# Altium schematic sheet Digital_Clock_SCH_4.0.SchDoc
size A; SheetNumber: 1; SheetTotal: 1
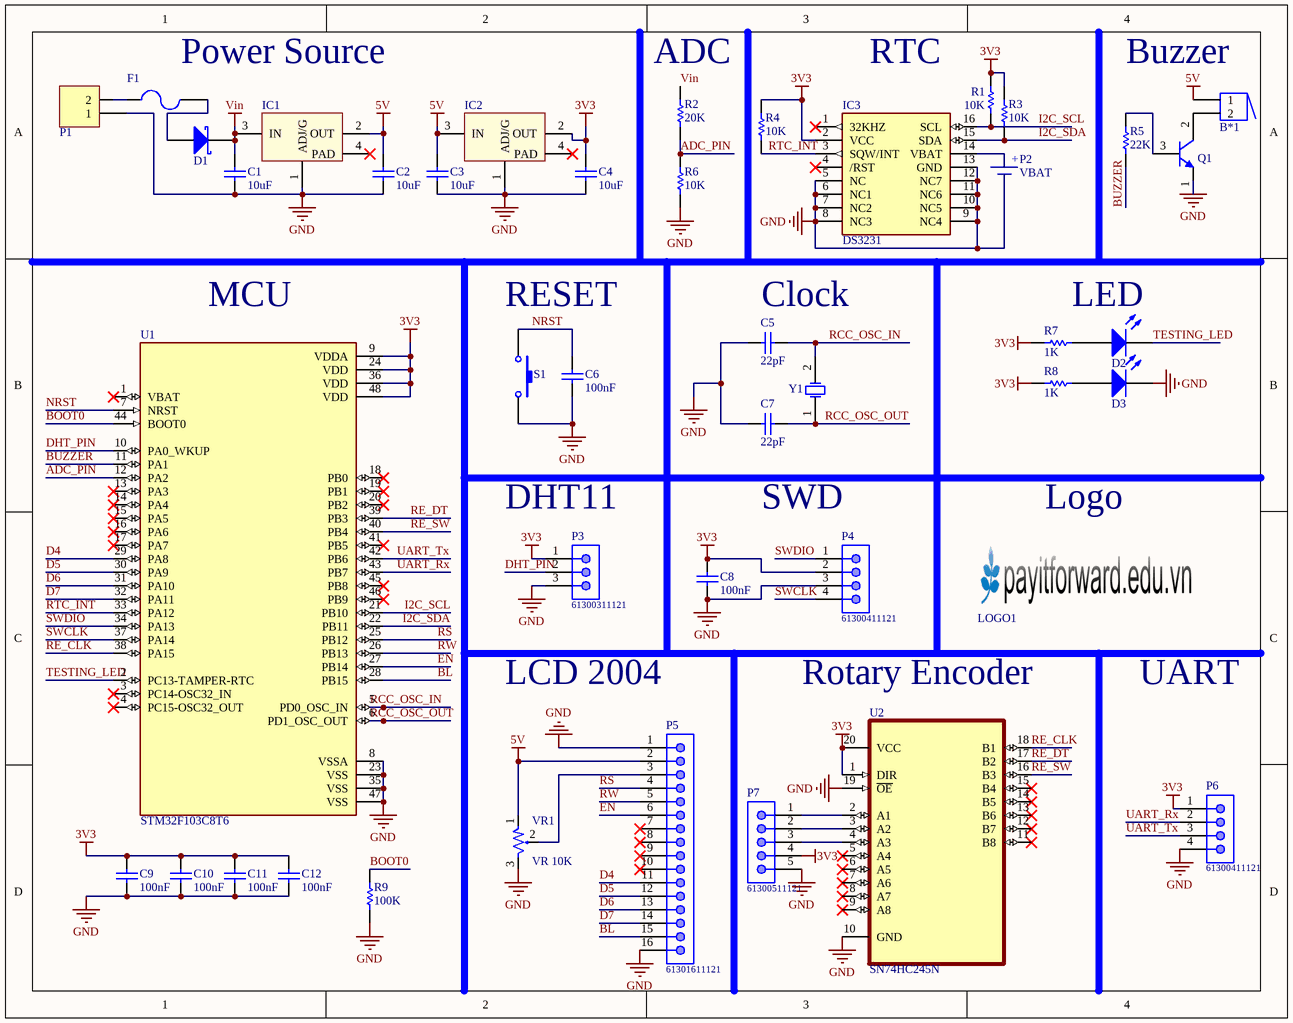
[diagram p0: Digital_Clock_SCH_4.0.SchDoc]

## Parts
B*1  Buzzer  [BUZZER]  (value not drawn)
C1  value 10uF  [CAP-SM-0805]  (hidden comment: Cap Non-Pol SMD)
C2  value 10uF  [CAP-SM-0805]  (hidden comment: Cap Non-Pol SMD)
C3  value 10uF  [CAP-SM-0805]  (hidden comment: Cap Non-Pol SMD)
C4  value 10uF  [CAP-SM-0805]  (hidden comment: Cap Non-Pol SMD)
C5  value 22pF  [CAP-SM-0603]  (hidden comment: Cap Non-Pol SMD)
C6  value 100nF  [CAP-SM-0603]  (hidden comment: Cap Non-Pol SMD)
C7  value 22pF  [CAP-SM-0603]  (hidden comment: Cap Non-Pol SMD)
C8  value 100nF  [CAP-SM-0603]  (hidden comment: Cap Non-Pol SMD)
C9  value 100nF  [CAP-SM-0603]  (hidden comment: Cap Non-Pol SMD)
C10  value 100nF  [CAP-SM-0603]  (hidden comment: Cap Non-Pol SMD)
C11  value 100nF  [CAP-SM-0603]  (hidden comment: Cap Non-Pol SMD)
C12  value 100nF  [CAP-SM-0603]  (hidden comment: Cap Non-Pol SMD)
D1  D Schottky  [SS34]  (value not drawn)
D2  LED SMD  [LED_0805_Blue]  (value not drawn)
D3  LED SMD  [LED_0805_Blue]  (value not drawn)
F1  Fuse  [FUSE SMD]  (value not drawn)
IC1  LM1117  [SOT223-4N]  (value not drawn)
IC2  LM1117  [SOT223-4N]  (value not drawn)
IC3  DS3231  [SO16W]  (value not drawn)
LOGO1  LOGO PIF  [PIF LOGO BIG SSTOP]  (value not drawn)
P1  Domino 2  [DOMINO SMALL 2]  (value not drawn)
P2  VBAT  [VBAT CR2030]
P3  61300311121  [61300311121]
P4  61300411121  [61300411121]
P5  61301611121  [61301611121]
P6  61300411121  [61300411121]
P7  61300511121  [61300511121]
Q1  C1815  [SOT23B]  (value not drawn)
R1  value 10K  [RES-SM-0603]  (hidden comment: RESISTOR SMD)
R2  value 20K  [RES-SM-0603]  (hidden comment: RESISTOR SMD)
R3  value 10K  [RES-SM-0603]  (hidden comment: RESISTOR SMD)
R4  value 10K  [RES-SM-0603]  (hidden comment: RESISTOR SMD)
R5  value 22K  [RES-SM-0603]  (hidden comment: RESISTOR SMD)
R6  value 10K  [RES-SM-0603]  (hidden comment: RESISTOR SMD)
R7  value 1K  [RES-SM-0603]  (hidden comment: RESISTOR SMD)
R8  value 1K  [RES-SM-0603]  (hidden comment: RESISTOR SMD)
R9  value 100K  [RES-SM-0603]  (hidden comment: RESISTOR SMD)
S1  Tact SW - 2Pin  [SW-SMD]  (value not drawn)
U1  STM32F103C8T6  [QFP50P900X900X160-48N]
U2  SN74HC245N  [DIP254P762X508-20]
VR1  value VR 10K  [Varistor 1]  (hidden comment: 10K)
Y1  XTAL  [XT2]  (value not drawn)

## Nets
3V3: C4.2 C8.2 C9.2 C10.2 C11.2 C12.2 IC2.2(OUT) IC3.2(VCC) P3.1 P4.2 P6.1 P7.4 R1.2 R3.2 R4.2 R7.1 R8.1 U1.9(VDDA) U1.24(VDD) U1.36(VDD) U1.48(VDD) U2.1(DIR) U2.20(VCC)
5V: B*1.1 C2.2 C3.2 IC1.2(OUT) IC2.3(IN) P5.2 VR1.1
GND: C1.1 C2.1 C3.1 C4.1 C5.1 C6.1 C7.2 C8.1 C9.1 C10.1 C11.1 C12.1 D3.2(K) IC1.1(ADJ/G) IC2.1(ADJ/G) IC3.5(NC) IC3.6(NC1) IC3.7(NC2) IC3.8(NC3) IC3.9(NC4) IC3.10(NC5) IC3.11(NC6) IC3.12(NC7) IC3.13(GND) P1.1 P2.2(+) P3.3 P4.3 P5.1 P5.16 P6.4 P7.5 Q1.1(E) R6.1 R9.1 S1.2 U1.8(VSSA) U1.23(VSS) U1.35(VSS) U1.47(VSS) U2.10(GND) U2.19(~{OE}) VR1.3
Vin: C1.2 D1.2(K) IC1.3(IN) R2.2
ADC_PIN: R2.1 R6.2 U1.12(PA2)
BL: P5.15 U1.28(PB15)
BOOT0: R9.2 U1.44(BOOT0)
BUZZER: R5.1 U1.11(PA1)
D4: P5.11 U1.29(PA8)
D5: P5.12 U1.30(PA9)
D6: P5.13 U1.31(PA10)
D7: P5.14 U1.32(PA11)
DHT_PIN: P3.2 U1.10(PA0_WKUP)
EN: P5.6 U1.27(PB14)
I2C_SCL: IC3.16(SCL) R1.1 U1.21(PB10)
I2C_SDA: IC3.15(SDA) R3.1 U1.22(PB11)
NRST: C6.2 S1.1 U1.7(NRST)
RCC_OSC_IN: C5.2 U1.5(PD0_OSC_IN) Y1.2(OSC2)
RCC_OSC_OUT: C7.1 U1.6(PD1_OSC_OUT) Y1.1(OSC1)
RE_CLK: U1.38(PA15) U2.18(B1)
RE_DT: U1.39(PB3) U2.17(B2)
RE_SW: U1.40(PB4) U2.16(B3)
RS: P5.4 U1.25(PB12)
RTC_INT: IC3.3(SQW/INT) R4.1 U1.33(PA12)
RW: P5.5 U1.26(PB13)
SWCLK: P4.4 U1.37(PA14)
SWDIO: P4.1 U1.34(PA13)
TESTING_LED: D2.2(K) U1.2(PC13-TAMPER-RTC)
UART_Rx: P6.2 U1.43(PB7)
UART_Tx: P6.3 U1.42(PB6)
NetB*1_2: B*1.2 Q1.2(C)
NetD1_1: D1.1(A) F1.1
NetD2_1: D2.1(A) R7.2
NetD3_1: D3.1(A) R8.2
NetF1_2: F1.2 P1.2
NetIC3_14: IC3.14(VBAT) P2.1(+)
NetP5_3: P5.3 VR1.2
NetP7_1: P7.1 U2.2(A1)
NetP7_2: P7.2 U2.3(A2)
NetP7_3: P7.3 U2.4(A3)
NetQ1_3: Q1.3(B) R5.2

Not connected (* = marked no-connect by the designer): IC1 4(PAD)*; IC2 4(PAD)*; IC3 1(32KHZ)* 4(/RST)*; P5 7* 8* 9* 10*; U1 1(VBAT)* 3(PC14-OSC32_IN)* 4(PC15-OSC32_OUT)* 13(PA3)* 14(PA4)* 15(PA5)* 16(PA6)* 17(PA7)* 18(PB0)* 19(PB1)* 20(PB2)* 41(PB5)* 45(PB8)* 46(PB9)*; U2 5(A4)* 6(A5)* 7(A6)* 8(A7)* 9(A8)* 11(B8)* 12(B7)* 13(B6)* 14(B5)* 15(B4)*

## Notes on the sheet
- (near F1) Power Source
- (near R2) ADC
- RTC
- (near B*1) Buzzer
- (near U1) MCU
- RESET
- (near C5) Clock
- LED
- (near P3) DHT11
- SWD
- Logo
- LCD 2004
- Rotary Encoder
- UART

## Library data of the parts
C1-C12 = Cap Non-Pol SMD: Capacitor
D1 = D Schottky: Schottky Diode; Published: 8-Jun-2000; LatestRevisionDate: 17-Jul-2002; LatestRevisionNote: Re-released for DXP Platform.; PackageReference: SMB; Publisher: Altium Limited; PackageDescription: DO-214-AA/SMB; 2 C-Bend Leads; Body 5.3 x 3.6 mm, inc. leads (LxW); Code_JEDEC: DO-214-AA
D2 D3 = LED SMD: LED
IC1 IC2 = LM1117: Available in 1.8V, 2.5V, 2.85V, 3.3V, 5V, and  Adjustable Versions; Value: LM317
P1 = Domino 2: Domino, 2-Pin; LatestRevisionDate: 17-Jul-2002; LatestRevisionNote: Re-released for DXP Platform.; Publisher: Altium Limited
P2 = VBAT CR2032: CR2032; Manufacturer: DANTONA INDUSTRIES; Manufacturer Part Number: CR2032 SANYO; Supplier 1: Newark; RoHS: NA; Stock 1: 1694; Pricing 1: 1=0.768, 5=0.655, 10=0.615, 25=0.565, 50=0.51, 100=0.46, 250=0.41 (USD); ComponentLink1URL: http://www.farnell.com/datasheets/1797668.pdf; ComponentLink1Description: http://www.farnell.com/datasheets/1797668.pdf; ComponentLink2URL: /datasheets/DANTONA/CRSANYO.pdf; ComponentLink2Description: /datasheets/DANTONA/CRSANYO.pdf
P3 = 61300311121: WR-PHD Pin Header, THT, pitch 2.54mm, Single Row, Vertical, 3p; Manufacturer: Wurth Elektronik; Pin Number: 3; Rated Current: 3A; Working Voltage: 250VAC; Withstanding Voltage: 500VAC; Contact Resistance: 20mOhm; ComponentLink1Description: Manufacturer; ComponentLink1URL: http://www.we-online.de; ComponentLink2Description: Datasheet; ComponentLink2URL: https://www.we-online.com/catalog/datasheet/61300311121.pdf; Manufacturer Part Number: 61300311121; Published Date: May 2020; Pitch: 2.54mm; Operating Temperature: -40 to +105degC; Mounting Technology: THT; Packaging: Bag; Gender: Pin Header; Row Number: Single; Orientation: Vertical
P4 P6 = 61300411121: WR-PHD Pin Header, THT, pitch 2.54mm, Single Row, Vertical, 4p; Manufacturer: Wurth Elektronik; Pin Number: 4; Rated Current: 3A; Working Voltage: 250VAC; Withstanding Voltage: 500VAC; Contact Resistance: 20mOhm; ComponentLink1Description: Manufacturer; ComponentLink1URL: http://www.we-online.de; ComponentLink2Description: Datasheet; ComponentLink2URL: https://www.we-online.com/catalog/datasheet/61300411121.pdf; Manufacturer Part Number: 61300411121; Published Date: May 2020; Pitch: 2.54mm; Operating Temperature: -40 to +105degC; Mounting Technology: THT; Packaging: Bag; Gender: Pin Header; Row Number: Single; Orientation: Vertical
P5 = 61301611121: WR-PHD Pin Header, THT, pitch 2.54mm, Single Row, Vertical, 16p; Manufacturer: Wurth Elektronik; Pin Number: 16; Rated Current: 3A; Working Voltage: 250VAC; Withstanding Voltage: 500VAC; Contact Resistance: 20mOhm; ComponentLink1Description: Manufacturer; ComponentLink1URL: http://www.we-online.de; ComponentLink2Description: Datasheet; ComponentLink2URL: https://www.we-online.com/catalog/datasheet/61301611121.pdf; Manufacturer Part Number: 61301611121; Published Date: May 2020; Pitch: 2.54mm; Operating Temperature: -40 to +105degC; Mounting Technology: THT; Packaging: Bag; Gender: Pin Header; Row Number: Single; Orientation: Vertical
P7 = 61300511121: WR-PHD Pin Header, THT, pitch 2.54mm, Single Row, Vertical, 5p; Manufacturer: Wurth Elektronik; Pin Number: 5; Rated Current: 3A; Working Voltage: 250VAC; Withstanding Voltage: 500VAC; Contact Resistance: 20mOhm; ComponentLink1Description: Manufacturer; ComponentLink1URL: http://www.we-online.de; ComponentLink2Description: Datasheet; ComponentLink2URL: https://www.we-online.com/catalog/datasheet/61300511121.pdf; Manufacturer Part Number: 61300511121; Published Date: May 2020; Pitch: 2.54mm; Operating Temperature: -40 to +105degC; Mounting Technology: THT; Packaging: Bag; Gender: Pin Header; Row Number: Single; Orientation: Vertical
Q1 = C1815: NPN Bipolar Transistor
R1-R9 = RESISTOR SMD: Resistor
S1 = Tact SW - 2Pin: Switch button 2 pin
U1 = STM32F103C8T6: Mainstream Performance line, ARM Cortex-M3 MCU with 64 Kbytes Flash, 72 MHz CPU, motor control, USB and CAN; Value: *; Availability: Unavailable; Price: None; Package: None; MP: STM32F103C8T6
U2 = SN74HC245N: Octal Bus Transceivers With 3-State Outputs 20-PDIP -40 to 85; MF: Texas Instruments; SnapEDA_Link: https://www.snapeda.com/parts/SN74HC245N/Texas%20Instruments/view-part/53757/?ref=snap; Availability: Good; Package: PDIP-20 Texas Instruments; Check_prices: https://www.snapeda.com/parts/SN74HC245N/Texas%20Instruments/view-part/53757/?ref=eda; Price: None; MP: SN74HC245N; Purchase-URL: https://pricing.snapeda.com/search/part/SN74HC245N/?ref=eda; Value: *
VR1 = Var Resistor
Y1 = XTAL: Crystal Oscillator; Published: 8-Jun-2000; LatestRevisionDate: 17-Jul-2002; LatestRevisionNote: Re-released for DXP Platform.; PackageReference: R38; Publisher: Altium Limited; PackageDescription: Crystal, Thru-Hole; 2 Leads; Body 3.1 x 8.2 mm (Dia.xH)
IC3 = DS3231: Package: None; Availability: Unavailable; Value: *; MP: DS3231; Price: None